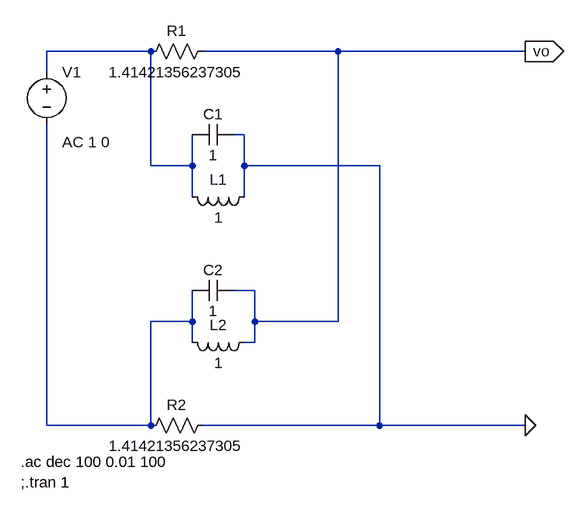
[diagram p0: schematic 20230726 - Ejercicio 1.asc]
20230726 - Ejercicio 1.asc, the LTspice schematic file:
Version 4
SHEET 1 880 756
WIRE 208 80 48 80
WIRE 496 80 288 80
WIRE 784 80 496 80
WIRE 48 112 48 80
WIRE 352 208 336 208
WIRE 208 256 208 80
WIRE 272 256 272 208
WIRE 272 256 208 256
WIRE 352 256 352 208
WIRE 560 256 352 256
WIRE 272 304 272 256
WIRE 352 304 352 256
WIRE 368 448 336 448
WIRE 272 496 272 448
WIRE 272 496 208 496
WIRE 368 496 368 448
WIRE 496 496 496 80
WIRE 496 496 368 496
WIRE 272 528 272 496
WIRE 368 528 368 496
WIRE 368 528 352 528
WIRE 48 656 48 192
WIRE 208 656 208 496
WIRE 208 656 48 656
WIRE 560 656 560 256
WIRE 560 656 288 656
WIRE 784 656 560 656
FLAG 784 656 0
FLAG 784 80 vo
IOPIN 784 80 Out
SYMBOL voltage 48 96 R0
WINDOW 123 24 124 Left 2
WINDOW 39 0 0 Left 0
SYMATTR Value2 AC 1 0
SYMATTR InstName V1
SYMATTR Value ""
SYMBOL res 304 64 R90
WINDOW 0 0 56 VBottom 2
WINDOW 3 32 56 VTop 2
SYMATTR InstName R1
SYMATTR Value 1.41421356237305
SYMBOL cap 336 192 R90
WINDOW 0 0 32 VBottom 2
WINDOW 3 32 32 VTop 2
SYMATTR InstName C1
SYMATTR Value 1
SYMBOL ind 368 288 R90
WINDOW 0 5 56 VBottom 2
WINDOW 3 32 56 VTop 2
SYMATTR InstName L1
SYMATTR Value 1
SYMATTR SpiceLine Rser=0
SYMBOL res 304 640 R90
WINDOW 0 0 56 VBottom 2
WINDOW 3 32 56 VTop 2
SYMATTR InstName R2
SYMATTR Value 1.41421356237305
SYMBOL cap 336 432 R90
WINDOW 0 0 32 VBottom 2
WINDOW 3 32 32 VTop 2
SYMATTR InstName C2
SYMATTR Value 1
SYMBOL ind 368 512 R90
WINDOW 0 5 56 VBottom 2
WINDOW 3 32 56 VTop 2
SYMATTR InstName L2
SYMATTR Value 1
SYMATTR SpiceLine Rser=0
TEXT 8 712 Left 2 !.ac dec 100 0.01 100\n;.tran 1

The netlist it stands for:
* 20230726 - Ejercicio 1.asc
V1 N001 N002 AC 1 0
R1 vo N001 1.41421356237305
C1 0 N001 1
L1 0 N001 1 Rser=0
R2 0 N002 1.41421356237305
C2 vo N002 1
L2 vo N002 1 Rser=0
.ac dec 100 0.01 100
;.tran 1
.backanno
.end